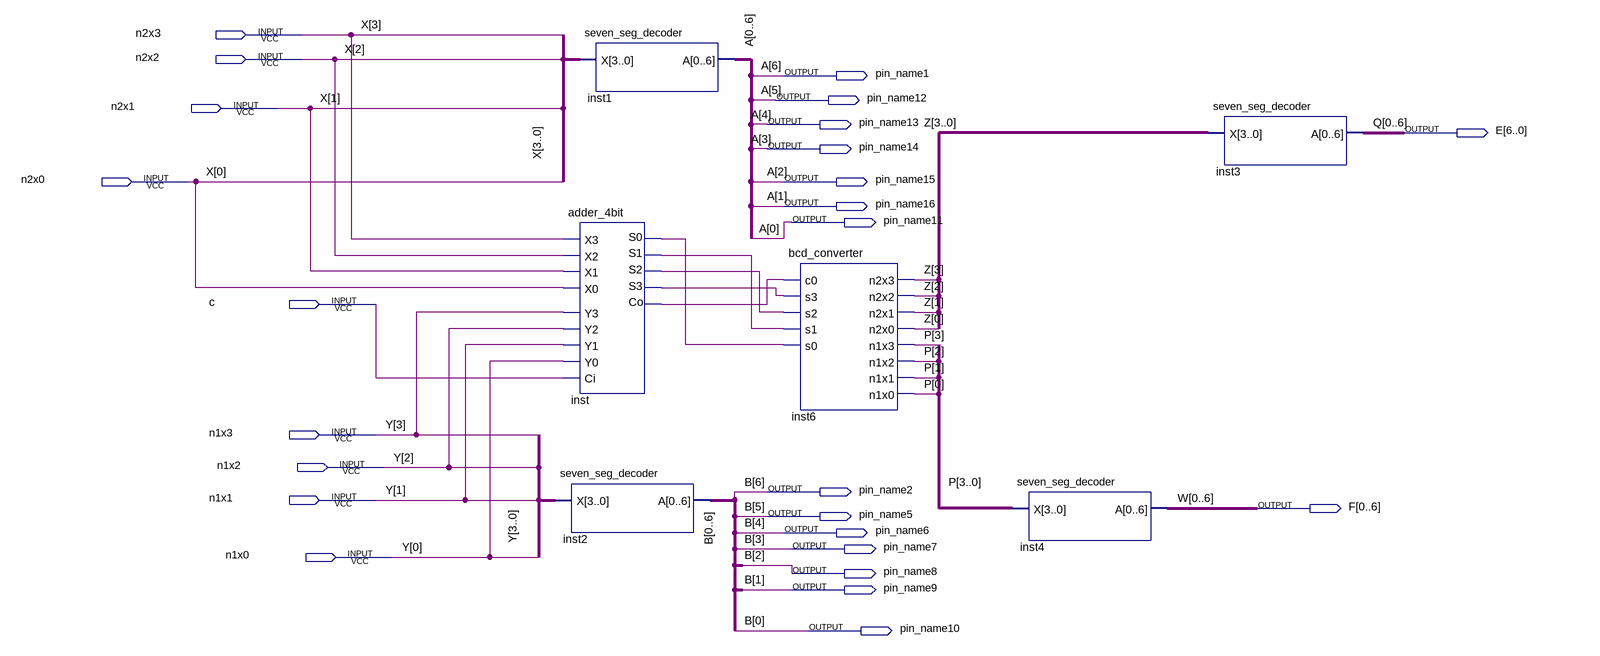
[diagram p0: schematic sheet]
// Quartus schematic Lab06.bdf as structural Verilog: 6 symbols, 25 pins
module Lab06 (
  input  n2x3,
  input  n2x2,
  input  n2x1,
  input  n2x0,
  input  c,
  input  n1x3,
  input  n1x2,
  input  n1x1,
  input  n1x0,
  output pin_name1,
  output pin_name12,
  output pin_name13,
  output [6:0] E,
  output pin_name14,
  output pin_name15,
  output pin_name16,
  output pin_name11,
  output pin_name2,
  output [0:6] F,
  output pin_name5,
  output pin_name6,
  output pin_name7,
  output pin_name8,
  output pin_name9,
  output pin_name10
);

  wire inst_co, inst_s0, inst_s1, inst_s2, inst_s3;
  wire [3:0] P, Z;

  seven_seg_decoder inst1 (
    .X({n2x3, n2x2, n2x1, n2x0}),
    .A({pin_name11, pin_name16, pin_name15, pin_name14, pin_name13, pin_name12, pin_name1}));
  adder_4bit inst (
    .X3(n2x3), .Y3(n1x3), .X2(n2x2), .Y2(n1x2), .X1(n2x1), .Y1(n1x1), .X0(n2x0), .Y0(n1x0), .Ci(c),
    .S0(inst_s0), .S1(inst_s1), .S2(inst_s2), .S3(inst_s3), .Co(inst_co));
  seven_seg_decoder inst2 (
    .X({n1x3, n1x2, n1x1, n1x0}),
    .A({pin_name10, pin_name9, pin_name8, pin_name7, pin_name6, pin_name5, pin_name2}));
  bcd_converter inst6 (
    .c0(inst_co), .s3(inst_s3), .s2(inst_s2), .s1(inst_s1), .s0(inst_s0), .n2x3(Z[3]), .n2x2(Z[2]),
    .n2x1(Z[1]), .n2x0(Z[0]), .n1x3(P[3]), .n1x2(P[2]), .n1x1(P[1]), .n1x0(P[0]));
  seven_seg_decoder inst4 (.X(P), .A(F));
  seven_seg_decoder inst3 (.X(Z), .A(E));

  // Other names for the same wires on the sheet: A[6:0] = {pin_name1, pin_name12, pin_name13, pin_name14, pin_name15, pin_name16, pin_name11};
  //   B[6:0] = {pin_name2, pin_name5, pin_name6, pin_name7, pin_name8, pin_name9, pin_name10};
  //   X[3:0] = {n2x3, n2x2, n2x1, n2x0}; Q[6:0] = {E[0], E[1], E[2], E[3], E[4], E[5], E[6]};
  //   W[6:0] = {F[6], F[5], F[4], F[3], F[2], F[1], F[0]}; Y[3:0] = {n1x3, n1x2, n1x1, n1x0}
endmodule
